# Altium project ESP8266-12F.PrjPcb
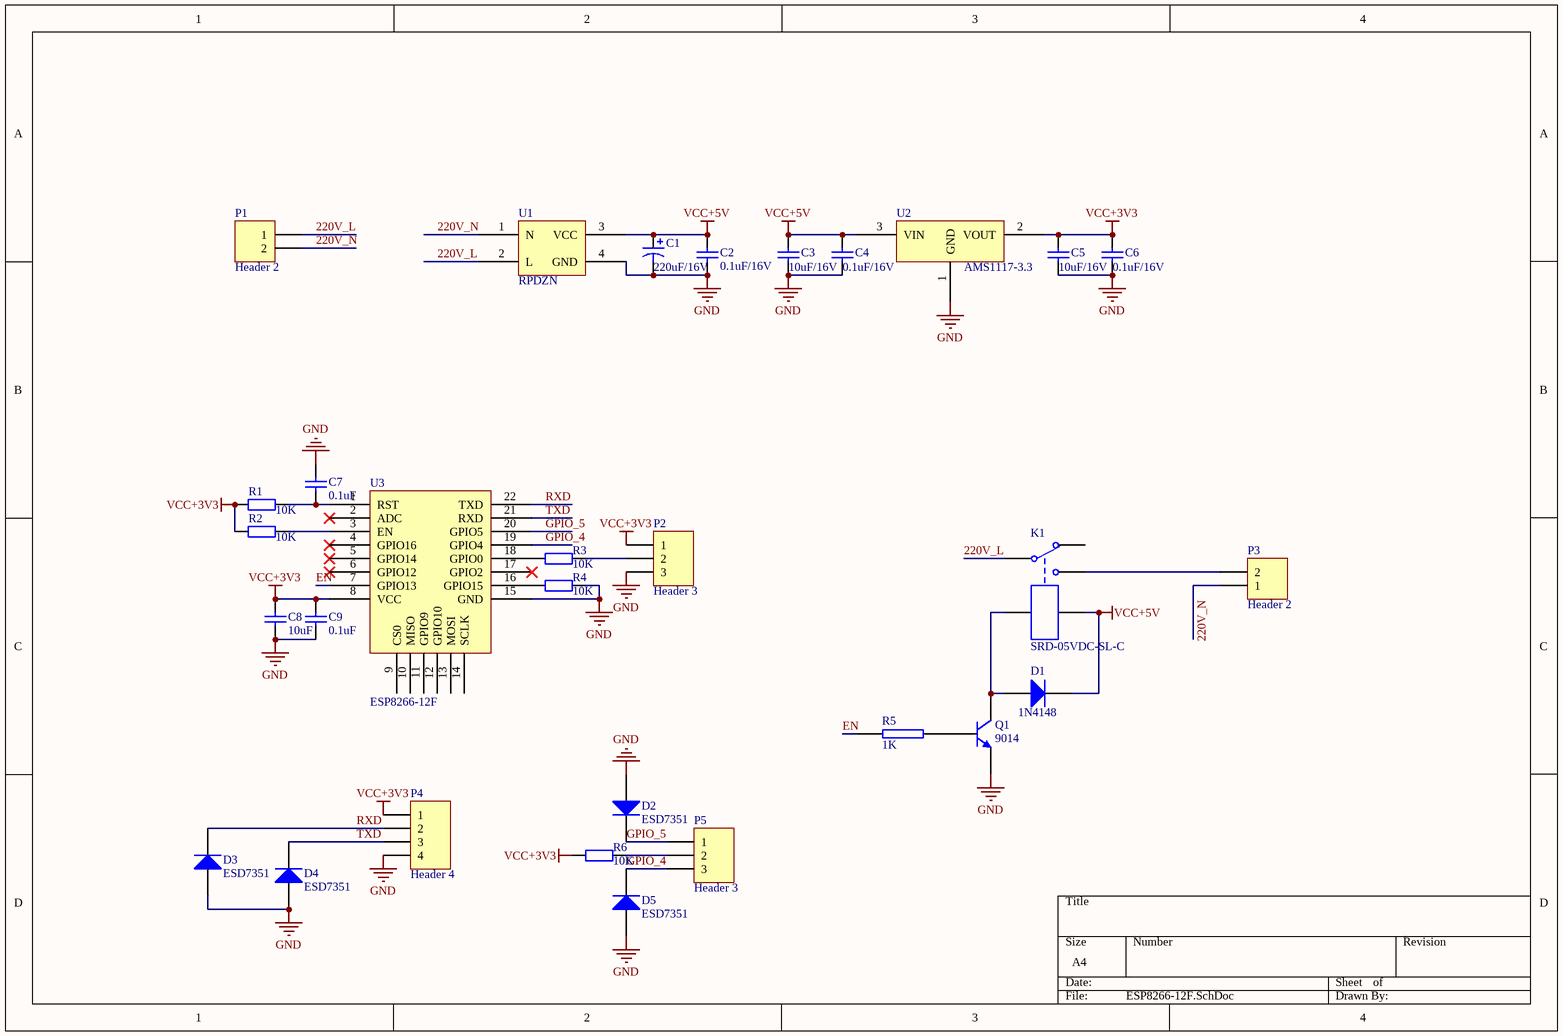
[diagram p0: ESP8266-12F.SchDoc]
1 sheet, 30 parts. Net scope: global (net labels, ports and power ports of the same name join across sheets).
Board file: ESP8266-12F.PcbDoc

## Sheet ESP8266-12F.SchDoc
size A4

### Parts
C1  220uF/16V  [CAP6.3]
C2  0.1uF/16V  [0603C]
C3  10uF/16V  [0603C]
C4  0.1uF/16V  [0603C]
C5  10uF/16V  [0603C]
C6  0.1uF/16V  [0603C]
C7  0.1uF  [0603C]
C8  10uF  [0603C]
C9  0.1uF  [0603C]
D1  1N4148  [SOD-323]
D2  ESD7351  [SOD-323]
D3  ESD7351  [SOD-323]
D4  ESD7351  [SOD-323]
D5  ESD7351  [SOD-323]
K1  SRD-05VDC-SL-C  [SRD-05VDC-SL-C]
P1  Header 2  [KF128-3.81-2P]
P2  Header 3  [HDR2.54-LI-3P]
P3  Header 2  [KF128-3.81-2P]
P4  Header 4  [HDR2.54-LI-4P]
P5  Header 3  [KF128-3.81-3P]
Q1  9014  [SOT23-3M]
R1  10K  [0603R]
R2  10K  [0603R]
R3  10K  [0603R]
R4  10K  [0603R]
R5  1K  [0603R]
R6  10K  [0603R]
U1  RPDZN  [RPDZN]
U2  AMS1117-3.3  [SOT223_M]
U3  ESP8266-12F  [ESP-12E&F Module]

### Nets
GND: C1.2 C2.1 C3.1 C4.1 C5.1 C6.1 C7.1 C8.2 C9.2 D2.1(A) D3.1(A) D4.1(A) D5.1(A) P2.3 P4.4 Q1.2(E) R4.2 U1.4(GND) U2.1(GND) U3.15(GND)
VCC+3V3: C5.2 C6.2 C8.1 C9.1 P2.1 P4.1 R1.1 R2.1 R6.2 U2.2(VOUT) U3.8(VCC)
VCC+5V: C1.1 C2.2 C3.2 C4.2 D1.2(K) K1.5 U1.3(VCC) U2.3(VIN)
220V_L: K1.1 P1.1 U1.2(L)
220V_N: P1.2 P3.1 U1.1(N)
EN: R5.2 U3.7(GPIO13)
GPIO_4: D5.2(K) P5.3 U3.19(GPIO4)
GPIO_5: D2.2(K) P5.1 U3.20(GPIO5)
RXD: D3.2(K) P4.2 U3.22(TXD)
TXD: D4.2(K) P4.3 U3.21(RXD)
NetC7_2: C7.2 R1.2 U3.1(RST)
NetD1_1: D1.1(A) K1.4 Q1.3(C)
NetK1_3: K1.3 P3.2
NetP2_2: P2.2 R3.1
NetP5_2: P5.2 R6.1
NetQ1_1: Q1.1(B) R5.1
NetR2_2: R2.2 U3.3(EN)
NetR3_2: R3.2 U3.18(GPIO0)
NetR4_1: R4.1 U3.16(GPIO15)

Not connected (* = marked no-connect by the designer): K1 2; U3 2(ADC)* 4(GPIO16)* 5(GPIO14)* 6(GPIO12)* 9(CS0) 10(MISO) 11(GPIO9) 12(GPIO10) 13(MOSI) 14(SCLK) 17(GPIO2)*

### Library data of the parts
C1 = Cap Pol1: Polarized Capacitor (Radial); Published: 8-Jun-2000; LatestRevisionDate: 17-Jul-2002; LatestRevisionNote: Re-released for DXP Platform.; PackageReference: RB7.6-15; Publisher: Altium Limited; Value: 220uF/16V
C2-C6 = Cap: Capacitor; Value: 0.1uF; Published: 8-Jun-2000; LatestRevisionDate: 17-Jul-2002; LatestRevisionNote: Re-released for DXP Platform.; PackageReference: RAD-0.3; Publisher: Altium Limited
C7-C9 = Cap: Capacitor; Published: 8-Jun-2000; LatestRevisionDate: 17-Jul-2002; LatestRevisionNote: Re-released for DXP Platform.; PackageReference: RAD-0.3; Publisher: Altium Limited
  C7 C9: Value: 0.1uF
  C8: Value: 10uF
D1 = Diode 1N4001: 1 Amp General Purpose Rectifier; Published: 8-Jun-2000; LatestRevisionDate: 17-Jul-2002; LatestRevisionNote: Re-released for DXP Platform.; DatasheetVersion: 1998; PackageVersion: Aug-1999; PackageReference: DO-41; Publisher: Altium Limited; PackageDescription: Diode, Axial; Body 5.2 x 2.7 mm (LxDia. max), Lead Dia. 0.86 mm (max); Code_JEDEC: DO-204-AL; ComponentLink1Description: Manufacturer Link; ComponentLink1URL: http://www.fairchildsemi.com/; ComponentLink2Description: Datasheet; ComponentLink2URL: http://www.fairchildsemi.com/ds/1N%2F1N4001.pdf
D2-D5 = Diode: Default Diode; Published: 8-Jun-2000; LatestRevisionDate: 17-Jul-2002; LatestRevisionNote: Re-released for DXP Platform.; PackageVersion: Sep-1996; PackageReference: SMC; Publisher: Altium Limited; Code_JEDEC: DO-214-AB
K1 = Relay-SPDT: Single-Pole Dual-Throw Relay; Published: 24-Mar-1999; LatestRevisionDate: 17-Jul-2002; LatestRevisionNote: Re-released for DXP Platform.; PackageReference: MODULE5B; Publisher: Altium Limited
P1 P3 = Header 2: Header, 2-Pin; LatestRevisionDate: 17-Jul-2002; LatestRevisionNote: Re-released for DXP Platform.; Publisher: Altium Limited
P2 P5 = Header 3: Header, 3-Pin; LatestRevisionDate: 17-Jul-2002; LatestRevisionNote: Re-released for DXP Platform.; Publisher: Altium Limited
P4 = Header 4: Header, 4-Pin; LatestRevisionDate: 17-Jul-2002; LatestRevisionNote: Re-released for DXP Platform.; Publisher: Altium Limited
R1-R4 R6 = Res2: Resistor; Published: 8-Jun-2000; LatestRevisionDate: 17-Jul-2002; LatestRevisionNote: Re-released for DXP Platform.; PackageReference: AXIAL-0.4; Publisher: Altium Limited; Value: 10K
R5 = RES2